# Altium project BLDC_driver.PrjPcb
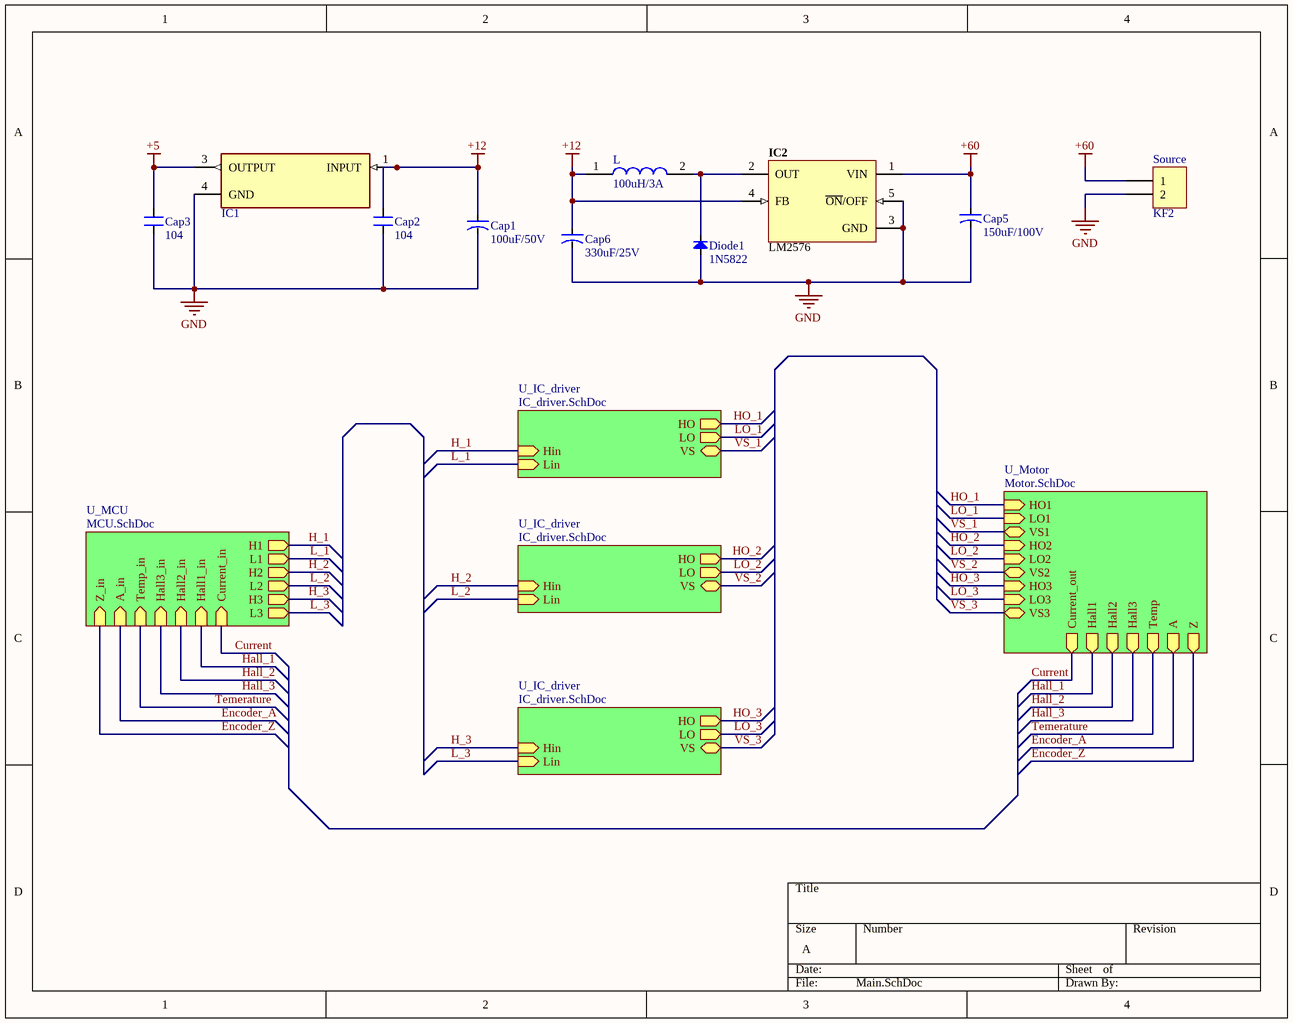
[diagram p0: Main.SchDoc]
4 sheets, 95 parts. Net scope: hierarchical (ports join the sheet entries above them; power ports are global).
Board files: PCB.PcbDoc, PCB1.PcbDoc
Sheets:
  Main.SchDoc
    U_IC_driver = IC_driver.SchDoc
    U_IC_driver = IC_driver.SchDoc
    U_IC_driver = IC_driver.SchDoc
    U_Motor = Motor.SchDoc
    U_MCU = MCU.SchDoc

## Sheet Main.SchDoc
size A

### Parts
Cap1  100uF/50V  [CAP FILM 1206]
Cap2  104  [CAP FILM 0603_1608]
Cap3  104  [CAP FILM 0603_1608]
Cap5  150uF/100V  [CAP TH ALUM ELEC D10.00mm S5.00mm H20.00mm]
Cap6  330uF/25V  [CAP-ALU-SMD-F]
Diode1  1N5822  [DIO-SMD-B]
IC1  L7805CD2T-TR  [STMicroelectronics_D²PAK_0079457_22_MFG]  (value not drawn)
IC2  LM2576  [TO263]
L  100uH/3A  [INDPM102100X400N]
Source  KF2  [KF2-5.08]

### Sub-sheets
U_IC_driver = IC_driver.SchDoc: HO (out), LO (out), VS (bidir), Hin (in), Lin (in)
U_IC_driver = IC_driver.SchDoc: HO (out), LO (out), VS (bidir), Hin (in), Lin (in)
U_IC_driver = IC_driver.SchDoc: HO (out), LO (out), VS (bidir), Hin (in), Lin (in)
U_MCU = MCU.SchDoc: H1 (out), L1 (out), H2 (out), L2 (out), H3 (out), L3 (out), Current_in (in), Hall1_in (in), Hall2_in (in), Hall3_in (in), Temp_in (in), A_in (in), Z_in (in)
U_Motor = Motor.SchDoc: HO1 (in), LO1 (in), VS1 (bidir), HO2 (in), LO2 (in), VS2 (bidir), HO3 (in), LO3 (in), VS3 (bidir), Current_out (out), Hall2 (out), Hall3 (out), Hall1 (out), Temp (out), A (out), Z (out)

### Nets
+5: Cap3.2 IC1.3(OUTPUT)
+12: Cap1.1 Cap2.2 Cap6.1 IC1.1(INPUT) IC2.4(FB) L.1
+60: Cap5.1 IC2.1(VIN) Source.1
GND: Cap1.2 Cap2.1 Cap3.1 Cap5.2 Cap6.2 Diode1.1(A) IC1.4(GND) IC2.3(GND) IC2.5(~{ON}/OFF) Source.2
Current: sheet U_Motor/Current_out, sheet U_MCU/Current_in
Encoder_A: sheet U_Motor/A, sheet U_MCU/A_in
Encoder_Z: sheet U_Motor/Z, sheet U_MCU/Z_in
H_1: sheet U_IC_driver/Hin, sheet U_MCU/H1
H_2: sheet U_IC_driver/Hin, sheet U_MCU/H2
H_3: sheet U_IC_driver/Hin, sheet U_MCU/H3
Hall_1: sheet U_Motor/Hall1, sheet U_MCU/Hall1_in
Hall_2: sheet U_Motor/Hall2, sheet U_MCU/Hall2_in
Hall_3: sheet U_Motor/Hall3, sheet U_MCU/Hall3_in
HO_1: sheet U_IC_driver/HO, sheet U_Motor/HO1
HO_2: sheet U_IC_driver/HO, sheet U_Motor/HO2
HO_3: sheet U_IC_driver/HO, sheet U_Motor/HO3
L_1: sheet U_IC_driver/Lin, sheet U_MCU/L1
L_2: sheet U_IC_driver/Lin, sheet U_MCU/L2
L_3: sheet U_IC_driver/Lin, sheet U_MCU/L3
LO_1: sheet U_IC_driver/LO, sheet U_Motor/LO1
LO_2: sheet U_IC_driver/LO, sheet U_Motor/LO2
LO_3: sheet U_IC_driver/LO, sheet U_Motor/LO3
Temerature: sheet U_Motor/Temp, sheet U_MCU/Temp_in
VS_1: sheet U_IC_driver/VS, sheet U_Motor/VS1  [project net P1]
VS_2: sheet U_IC_driver/VS, sheet U_Motor/VS2  [project net P2]
VS_3: sheet U_IC_driver/VS, sheet U_Motor/VS3  [project net P3]
NetDiode1_2: Diode1.2(K) IC2.2(OUT) L.2

### Library data of the parts
Cap1 Cap5 Cap6 = CN-ALU-SMD: Polarized Capacitor (Axial); Published: 8-Jun-2000; LatestRevisionDate: 17-Jul-2002; LatestRevisionNote: Re-released for DXP Platform.; PackageReference: POLAR0.8; Publisher: Altium Limited
Cap2 Cap3 = CN2: Cap np 104 => 105pF; Value: 0.1uF
Diode1 = Diode SMD: Default Diode; Code - JEDEC: DO-214-AB; Value: 1N5007; Published: 8-Jun-2000; Revision: July-2002: Re-released for DXP Platform.; Publisher: Altium Limited
IC2 = LM2596: Max Input Voltage: 12 V; Max Output Current: 3 (6.0 peak) A; Max Output Voltage: mV; Category: IC-Power; Min Input Voltage: mV; Min Output Voltage: mV; Mounting Technology: Surface Mount; Status: Unreleased; Supply Voltage: mV; Temperature Range: -40 to +125 degC
L = CDRH104RNP-680NC: Inductor; Manufacturer_Name: Sumida; Datasheet Link: http://products.sumida.com/products/pdf/CDRH104,104R.pdf; Height: 4mm; Manufacturer_Part_Number: CDRH104RNP-680NC; Mouser Part Number: 851-CDRH104RNP-680NC; Mouser Price/Stock: https://www.mouser.co.uk/ProductDetail/Sumida/CDRH104RNP-680NC/?qs=b6HGhii3QUSW0bjw2331%2Fg%3D%3D; Arrow Part Number: CDRH104RNP-680NC; Arrow Price/Stock: https://www.arrow.com/en/products/cdrh104rnp-680nc/sumida
Source = KF2: Manufacturer: Würth Elektronik eiSos GmbH; partNo: 691103110002; ComponentLink1 Description: Manufacturer; ComponentLink2 Description: Datasheet; NoPins: 2; Created Date: 29 October 2013; ComponentLink1URL: http://www.we-online.com; ComponentLink2URL: http://katalog.we-online.de/em/datasheet/6911031100xx.pdf; Created by: Karrer Zheng

## Sheet IC_driver.SchDoc
size A
Used 3 times, as channels U_IC_driver, U_IC_driver, U_IC_driver. Parts and nets are listed once, with the designators drawn on the sheet.
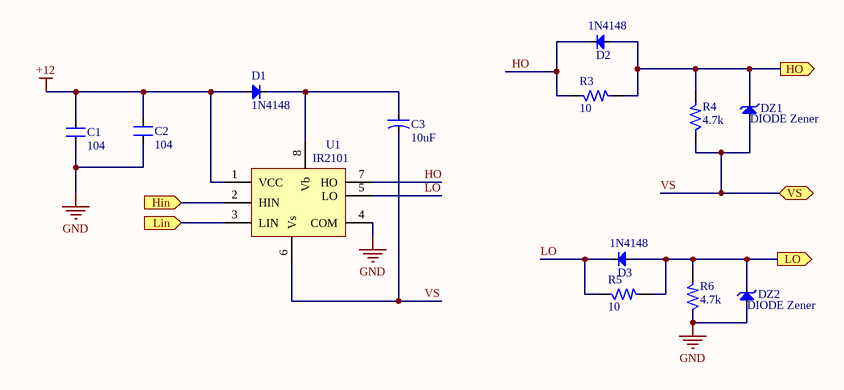
[diagram p1: IC_driver.SchDoc]

### Parts
C1  104  [CAP FILM 0603_1608]
C2  104  [CAP FILM 0603_1608]
C3  10uF  [CAP FILM 0805]
D1  1N4148  [SOD323]
D2  1N4148  [SOD323]
D3  1N4148  [SOD323]
DZ1  DIODE Zener  [DIODES SOT-23-3]
DZ2  DIODE Zener  [DIODES SOT-23-3]
R3  10  [RES 0603_1608]
R4  4.7k  [RES 0603_1608]
R5  10  [RES 0603_1608]
R6  4.7k  [RES 0603_1608]
U1  IR2101  [SO8]

### Ports
Hin (in), HO (out), Lin (in), LO (out), VS (bidir)

### Nets
+12: C1.2 C2.2 D1.1(A) U1.1(VCC)
GND: C1.1 C2.1 DZ2.1(A) R6.1 U1.4(COM)
Hin: U1.2(HIN) ; port Hin
HO: D2.2(K) R3.1 U1.7(HO)
HO: D2.1(A) DZ1.2(K) R3.2 R4.2 ; port HO  [a separate net that carries the same name]
Lin: U1.3(LIN) ; port Lin
LO: D3.2(K) R5.1 U1.5(LO)
LO: D3.1(A) DZ2.2(K) R5.2 R6.2 ; port LO  [a separate net that carries the same name]
VS: C3.2 DZ1.1(A) R4.1 U1.6(Vs) ; port VS
NetC3_1: C3.1 D1.2(K) U1.8(Vb)

### Channels
U_IC_driver: designators end in C; ports Hin=H_1 HO=HO_1 Lin=L_1 LO=LO_1 VS=P1
U_IC_driver: designators end in B; ports Hin=H_2 HO=HO_2 Lin=L_2 LO=LO_2 VS=P2
U_IC_driver: designators end in A; ports Hin=H_3 HO=HO_3 Lin=L_3 LO=LO_3 VS=P3

### Library data of the parts
C1 C2 = CN: Value: 0,1uF/300V; Designed by: VanDungEvn
C3 = CN-ALU-SMD: Polarized Capacitor (Axial); Published: 8-Jun-2000; LatestRevisionDate: 17-Jul-2002; LatestRevisionNote: Re-released for DXP Platform.; PackageReference: POLAR0.8; Publisher: Altium Limited
D1-D3 = Diode SMD: as Diode1 on sheet Main; Published: 8-Jun-2000; Revision: July-2002: Re-released for DXP Platform.; Publisher: Altium Limited
DZ1 DZ2 = DIODE Zener: Zenner
R3-R6 = R: Resistor 1/4W; Value: R1/4W - 1K
U1 = IR2101S: Half-Bridge Driver

## Sheet Motor.SchDoc
size A
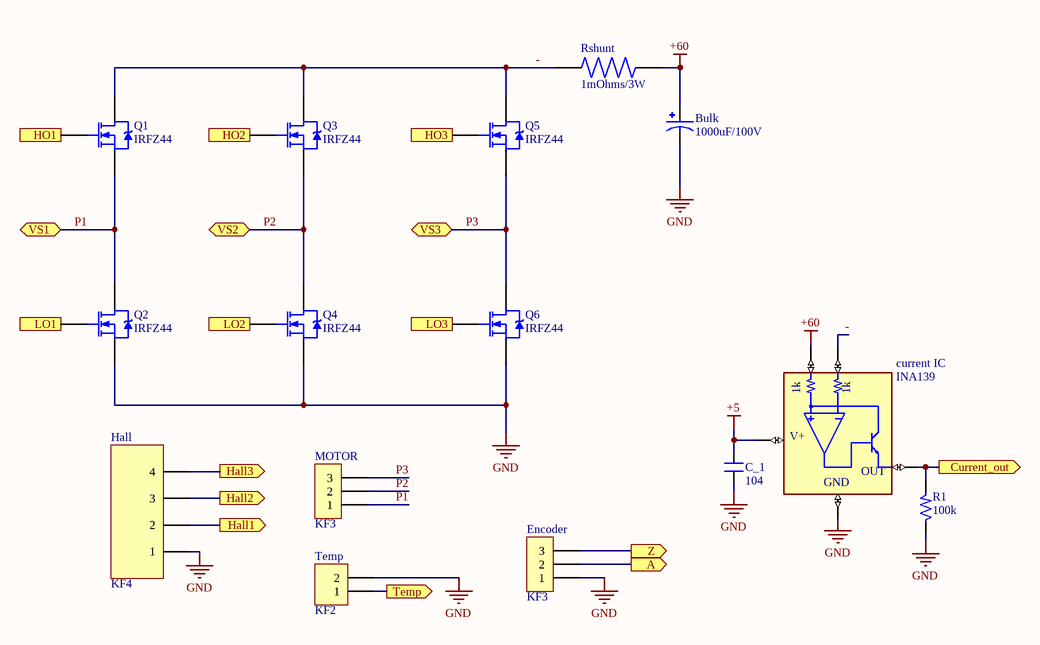
[diagram p2: Motor.SchDoc]

### Parts
Bulk  1000uF/100V  [CAPPRD750W80D1800H3550]
C_1  104  [CAP FILM 0603_1608]
current_IC  INA139  [MICROCHIP SOT-23-5 OT]
Encoder  KF3  [KF3-5.08]
Hall  KF4  [KF4-5.08]
MOTOR  KF3  [KF3-5.08]
Q1  IRFZ44  [DPAK508P1524X483-3N]
Q2  IRFZ44  [DPAK508P1524X483-3N]
Q3  IRFZ44  [DPAK508P1524X483-3N]
Q4  IRFZ44  [DPAK508P1524X483-3N]
Q5  IRFZ44  [DPAK508P1524X483-3N]
Q6  IRFZ44  [DPAK508P1524X483-3N]
R1  100k  [RES 0603_1608]
Rshunt  1mOhms/3W  [RESM11569X253N]
Temp  KF2  [KF2-5.08]

### Ports
A (out), Current_out (out), Hall1 (out), Hall2 (out), Hall3 (out), HO1 (in), HO2 (in), HO3 (in), LO1 (in), LO2 (in), LO3 (in), Temp (out), VS1 (bidir), VS2 (bidir), VS3 (bidir), Z (out)

### Nets
+5: C_1.1 current_IC.5(V+)
+60: Bulk.P current_IC.3(VIN+) Rshunt.2
GND: Bulk.N C_1.2 current_IC.2(GND) Encoder.1 Hall.1 Q2.3(S) Q4.3(S) Q6.3(S) R1.1 Temp.2
-: current_IC.4(VIN-) Q1.2(D) Q3.2(D) Q5.2(D) Rshunt.1
Current: current_IC.1(OUT) R1.2 ; port Current_out
Encoder_A: Encoder.2 ; port A
Encoder_Z: Encoder.3 ; port Z
Hall_1: Hall.2 ; port Hall1
Hall_2: Hall.3 ; port Hall2
Hall_3: Hall.4 ; port Hall3
HO_1: Q1.1(G) ; port HO1
HO_2: Q3.1(G) ; port HO2
HO_3: Q5.1(G) ; port HO3
LO_1: Q2.1(G) ; port LO1
LO_2: Q4.1(G) ; port LO2
LO_3: Q6.1(G) ; port LO3
P1: MOTOR.1 Q1.3(S) Q2.2(D) ; port VS1
P2: MOTOR.2 Q3.3(S) Q4.2(D) ; port VS2
P3: MOTOR.3 Q5.3(S) Q6.2(D) ; port VS3
Temerature: Temp.1 ; port Temp

### Notes on the sheet
- (in symbol INA139) 1k

### Library data of the parts
Bulk = ECA2AHG102E: Aluminum Electrolytic Capacitors, NHG-A Series, 1000uF +/- 20%, 100V, Radial lead type(18x35.5mm); MF: Panasonic; MP: ECA-2AHG102E; SnapEDA_Link: https://www.snapeda.com/parts/ECA-2AHG102E/Panasonic/view-part/6221685/?ref=snap; Availability: In Stock; Value: *; Check_prices: https://www.snapeda.com/parts/ECA-2AHG102E/Panasonic/view-part/6221685/?ref=eda; Package: RADIAL-2 Panasonic; Price: None
C_1 = CN: as C1 on sheet IC_driver
current_IC = INA139: Current Monitor Regulator High-Side SOT-23-5; MF: Texas Instruments; Package: SOT-23-5 Texas Instruments; Value: *; Availability: Unavailable; MP: INA139; SnapEDA_Link: https://www.snapeda.com/parts/INA139/Texas%20Instruments/view-part/560986/?ref=snap; Price: None
Encoder MOTOR = KF3: Manufacturer: Würth Elektronik eiSos GmbH; partNo: 691103110003; ComponentLink1 Description: Manufacturer; ComponentLink2 Description: Datasheet; NoPins: 3; Created Date: 29 October 2013; ComponentLink1URL: http://www.we-online.com; ComponentLink2URL: http://katalog.we-online.de/em/datasheet/6911031100xx.pdf; Created by: Karrer Zheng
Hall = KF4: Manufacturer: W¨¹rth Elektronik eiSos GmbH; PartNo: 691133710004; ComponentLink1 Description: Manufacturer; ComponentLink2 Description: Datasheet; NoPins: 4; ComponentLink1 URL: http://www.we-online.com; ComponentLink2 URL: http://katalog.we-online.de/em/datasheet/6911337100xx.pdf; Created By: Baojun Chen; Created Date: 4-Aug-15
Q1-Q6 = IRFZ44: HEXFET N-Channel Power MOSFET
R1 = R: Resistor 1/4W; Value: R1/4W - 1K
Rshunt = WSR31L000FEA: 3 mOhms Â±1% 5W Chip Resistor 4527 J-Lead Anti-Sulfur, Automotive AEC-Q200, Current Sense, Moisture Resistant, Pulse Withstanding Metal Element; Package: None; Price: None; Value: *; MP: WSR31L000FEA; Availability: Unavailable
Temp = KF2: as Source on sheet Main; Created Date: 29 October 2013; ComponentLink1URL: http://www.we-online.com; ComponentLink2URL: http://katalog.we-online.de/em/datasheet/6911031100xx.pdf; Created by: Karrer Zheng

## Sheet MCU.SchDoc
size A
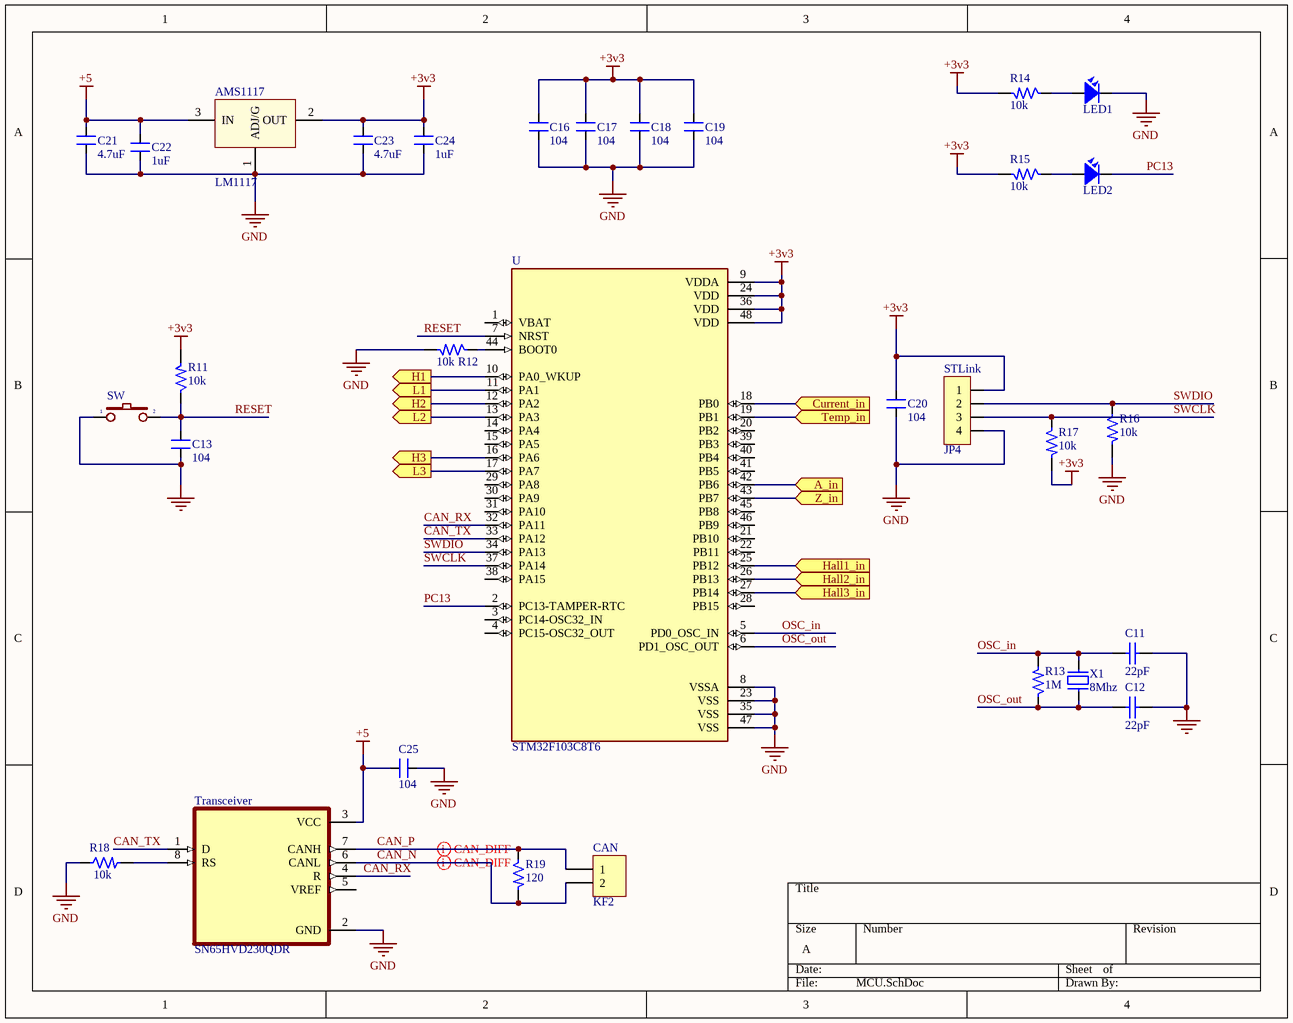
[diagram p3: MCU.SchDoc]

### Parts
AMS1117  LM1117  [SOT223-4N]
C11  22pF  [CAP FILM 0603_1608]
C12  22pF  [CAP FILM 0603_1608]
C13  104  [CAP FILM 0603_1608]
C16  104  [CAP FILM 0603_1608]
C17  104  [CAP FILM 0603_1608]
C18  104  [CAP FILM 0603_1608]
C19  104  [CAP FILM 0603_1608]
C20  104  [CAP FILM 0603_1608]
C21  4.7uF  [CAP FILM 0603_1608]
C22  1uF  [CAP FILM 0603_1608]
C23  4.7uF  [CAP FILM 0603_1608]
C24  1uF  [CAP FILM 0603_1608]
C25  104  [CAP FILM 0603_1608]
CAN  KF2  [KF2-5.08]
LED1  LED SMD  [LED 0603_1608 GREEN]  (value not drawn)
LED2  LED SMD  [LED 0603_1608 GREEN]  (value not drawn)
R11  10k  [RES 0603_1608]
R12  10k  [RES 0603_1608]
R13  1M  [RES 0603_1608]
R14  10k  [RES 0603_1608]
R15  10k  [RES 0603_1608]
R16  10k  [RES 0603_1608]
R17  10k  [RES 0603_1608]
R18  10k  [RES 0603_1608]
R19  120  [RES 0603_1608]
STLink  JP4  [JP4-D1C]
SW  (no value)  [SW1-SMD]
Transceiver  SN65HVD230QDR  [SOIC127P599X175-8N]
U  STM32F103C8T6  [QFP50P900X900X160-48N]
X1  8Mhz  [XTAL-RU49/4]

### Ports
A_in (in), Current_in (in), H1 (out), H2 (out), H3 (out), Hall1_in (in), Hall2_in (in), Hall3_in (in), L1 (out), L2 (out), L3 (out), Temp_in (in), Z_in (in)

### Nets
+3v3: AMS1117.2(OUT) C16.1 C17.1 C18.1 C19.1 C20.1 C23.1 C24.1 R11.2 R14.2 R15.2 R17.2 STLink.1 U.9(VDDA) U.24(VDD) U.36(VDD) U.48(VDD)
+5: AMS1117.3(IN) C21.1 C22.1 C25.1 Transceiver.3(VCC)
GND: AMS1117.1(ADJ/G) C11.1 C12.1 C13.2 C16.2 C17.2 C18.2 C19.2 C20.2 C21.2 C22.2 C23.2 C24.2 C25.2 LED1.2 R12.2 R16.2 R18.1 STLink.4 SW.1 Transceiver.2(GND) U.8(VSSA) U.23(VSS) U.35(VSS) U.47(VSS)
CAN_N: CAN.2 R19.2 Transceiver.6(CANL)
CAN_P: CAN.1 R19.1 Transceiver.7(CANH)
CAN_RX: Transceiver.4(R) U.32(PA11)
CAN_TX: Transceiver.1(D) U.33(PA12)
Current: U.18(PB0) ; port Current_in
Encoder_A: U.42(PB6) ; port A_in
Encoder_Z: U.43(PB7) ; port Z_in
H_1: U.10(PA0_WKUP) ; port H1
H_2: U.12(PA2) ; port H2
H_3: U.16(PA6) ; port H3
Hall_1: U.25(PB12) ; port Hall1_in
Hall_2: U.26(PB13) ; port Hall2_in
Hall_3: U.27(PB14) ; port Hall3_in
L_1: U.11(PA1) ; port L1
L_2: U.13(PA3) ; port L2
L_3: U.17(PA7) ; port L3
OSC_in: C11.2 R13.2 U.5(PD0_OSC_IN) X1.2
OSC_out: C12.2 R13.1 U.6(PD1_OSC_OUT) X1.1
PC13: LED2.2 U.2(PC13-TAMPER-RTC)
RESET: C13.1 R11.1 SW.2 U.7(NRST)
SWCLK: R17.1 STLink.3 U.37(PA14)
SWDIO: R16.1 STLink.2 U.34(PA13)
Temerature: U.19(PB1) ; port Temp_in
NetLED1_1: LED1.1 R14.1
NetLED2_1: LED2.1 R15.1
NetR12_1: R12.1 U.44(BOOT0)
NetR18_2: R18.2 Transceiver.8(RS)

Not connected (* = marked no-connect by the designer): Transceiver 5(VREF); U 1(VBAT) 3(PC14-OSC32_IN) 4(PC15-OSC32_OUT) 14(PA4) 15(PA5) 20(PB2) 21(PB10) 22(PB11) 28(PB15) 29(PA8) 30(PA9) 31(PA10) 38(PA15) 39(PB3) 40(PB4) 41(PB5) 45(PB8) 46(PB9)

### Layout directives
differential pair; differential pair class CAN_DIFF: CAN_N, CAN_P

### Library data of the parts
AMS1117 = LM1117: Available in 1.8V, 2.5V, 2.85V, 3.3V, 5V, and  Adjustable Versions; Value: LM317
C11 C12 = CapSMD: Capacitor; Value: 33p; Published: 8-Jun-2000; LatestRevisionDate: 17-Jul-2002; LatestRevisionNote: Re-released for DXP Platform.; PackageReference: RAD-0.3; Publisher: Altium Limited
C13 C16-C25 = CN: as C1 on sheet IC_driver
CAN = KF2: as Source on sheet Main; Created Date: 29 October 2013; ComponentLink1URL: http://www.we-online.com; ComponentLink2URL: http://katalog.we-online.de/em/datasheet/6911031100xx.pdf; Created by: Karrer Zheng
LED1 LED2 = LED-SMD-0805
R11-R19 = R: Resistor 1/4W; Value: R1/4W - 1K
STLink = JP4: WR-PHD 2.54 mm Angled Socket Header; Manufacturer: W¨¹rth Elektronik eiSos GmbH; partNo: 613004143121; ComponentLink1 Description: Manufacturer; ComponentLink2 Description: Datasheet; NoPins: 04; Created Date: 29 March 2013; ComponentLink1URL: http://www.we-online.com; ComponentLink2URL: http://katalog.we-online.de/em/datasheet/6130xx143121.pdf; Created by: Karrer Zheng
SW = SW2: Switch button 2 pin; Value: SW chip 2 pin
Transceiver = SN65HVD230QDR: 3.3-V CAN Transceiver with Standby Mode 8-SOIC -40 to 125; MF: Texas Instruments; Package: SOIC-8 Texas Instruments; Price: None; MP: SN65HVD230QDR; Availability: Good; Value: *; Check_prices: https://www.snapeda.com/parts/SN65HVD230QDR/Texas%20Instruments/view-part/1178075/?ref=eda; Purchase-URL: https://pricing.snapeda.com/search/part/SN65HVD230QDR/?ref=eda; SnapEDA_Link: https://www.snapeda.com/parts/SN65HVD230QDR/Texas%20Instruments/view-part/1178075/?ref=snap
U = STM32F103C8T6: ARMÂ® CortexÂ®-M3 STM32F1 Microcontroller IC 32-Bit 72MHz 64KB _64K x 8_ FLASH; MF: STMicroelectronics; Price: None; Package: LQFP-48 STMicroelectronics; Value: *; MP: STM32F103C8T6; Availability: Unavailable; SnapEDA_Link: https://www.snapeda.com/parts/STM32F103C8T6/STMicroelectronics/view-part/52195/?ref=snap
X1 = XT2: Crystal, 32.768 KHz, -40 to 85 degC, 3.2 x 1.5 x 0.9 mm SMD; Value: 4Mhz

## Nets that join several sheets
+5: Main (Cap3.2 IC1.3), Motor (C_1.1 current_IC.5), MCU (5 pins)
+12: Main (6 pins), U_IC_driver (C1C.2 C2C.2 D1C.1 U1C.1), U_IC_driver (C1B.2 C2B.2 D1B.1 U1B.1), U_IC_driver (C1A.2 C2A.2 D1A.1 U1A.1)
+60: Main (Cap5.1 IC2.1 Source.1), Motor (Bulk.P current_IC.3 Rshunt.2)
GND: Main (10 pins), U_IC_driver (5 pins), U_IC_driver (5 pins), U_IC_driver (5 pins), Motor (10 pins), MCU (25 pins)
Current: Motor (current_IC.1 R1.2), MCU (U.18)
Encoder_A: Motor (Encoder.2), MCU (U.42)
Encoder_Z: Motor (Encoder.3), MCU (U.43)
H_1: U_IC_driver (U1C.2), MCU (U.10)
H_2: U_IC_driver (U1B.2), MCU (U.12)
H_3: U_IC_driver (U1A.2), MCU (U.16)
Hall_1: Motor (Hall.2), MCU (U.25)
Hall_2: Motor (Hall.3), MCU (U.26)
Hall_3: Motor (Hall.4), MCU (U.27)
HO_1: U_IC_driver (D2C.1 DZ1C.2 R3C.2 R4C.2), Motor (Q1.1)
HO_2: U_IC_driver (D2B.1 DZ1B.2 R3B.2 R4B.2), Motor (Q3.1)
HO_3: U_IC_driver (D2A.1 DZ1A.2 R3A.2 R4A.2), Motor (Q5.1)
L_1: U_IC_driver (U1C.3), MCU (U.11)
L_2: U_IC_driver (U1B.3), MCU (U.13)
L_3: U_IC_driver (U1A.3), MCU (U.17)
LO_1: U_IC_driver (D3C.1 DZ2C.2 R5C.2 R6C.2), Motor (Q2.1)
LO_2: U_IC_driver (D3B.1 DZ2B.2 R5B.2 R6B.2), Motor (Q4.1)
LO_3: U_IC_driver (D3A.1 DZ2A.2 R5A.2 R6A.2), Motor (Q6.1)
P1: U_IC_driver (C3C.2 DZ1C.1 R4C.1 U1C.6), Motor (MOTOR.1 Q1.3 Q2.2)
P2: U_IC_driver (C3B.2 DZ1B.1 R4B.1 U1B.6), Motor (MOTOR.2 Q3.3 Q4.2)
P3: U_IC_driver (C3A.2 DZ1A.1 R4A.1 U1A.6), Motor (MOTOR.3 Q5.3 Q6.2)
Temerature: Motor (Temp.1), MCU (U.19)